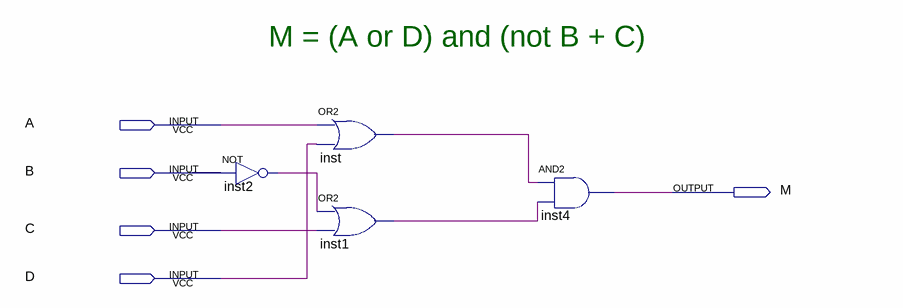
[diagram p0: schematic sheet]
// Quartus schematic majakEA.bdf as structural Verilog: 4 symbols, 5 pins
module majakEA (
  input  A,
  input  B,
  input  C,
  input  D,
  output M
);

  wire inst1_out, inst2_out, inst_out;

  not inst2 (inst2_out, B);
  or inst (inst_out, A, D);
  or inst1 (inst1_out, inst2_out, C);
  and inst4 (M, inst_out, inst1_out);

  // Notes on the sheet:
  //   M = (A or D) and (not B + C)
endmodule
